# Altium project bootleg-ev.PrjPcb
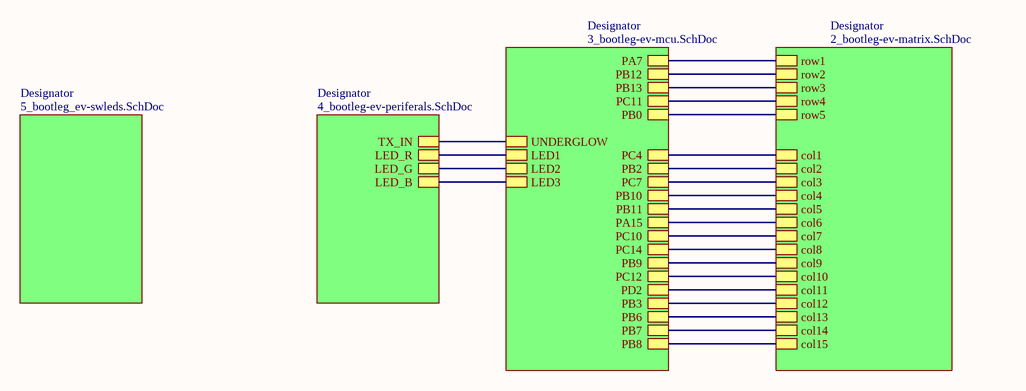
[diagram p0: 1_bootleg-ev_top.SchDoc]
Revision: B2 - MX; ProjectTitle: bootlegs
4 sheets, 169 parts. Net scope: hierarchical (ports join the sheet entries above them; power ports are global).
Board file: bootleg-ev.PcbDoc
Sheets:
  1_bootleg-ev_top.SchDoc
    Designator = 3_bootleg-ev-mcu.SchDoc
    Designator = 2_bootleg-ev-matrix.SchDoc
    Designator = 4_bootleg-ev-periferals.SchDoc

## Sheet 1_bootleg-ev_top.SchDoc: =ProjectTitle
size A4; Address1: github.com/4pplet/bootlegs; Address2: Licence: CERN-OHL-S; Address4: www.4pplet.com; Revision: B2 - MX; SheetNumber: 1; SheetTotal: 4; ProjectName: waffling60

### Sub-sheets
Designator = 3_bootleg-ev-mcu.SchDoc: PB10, PB3, PB8, PB9, PC10, PB0, PC11, PB7, PA15, PB6, PC14, PB13, PD2, UNDERGLOW, LED2, LED1, LED3, PC12, PB2, PB12, PB11, PA7, PC7, PC4
Designator = 2_bootleg-ev-matrix.SchDoc: col5, col7, col3, col1, row3, row1, row4, row2, row5, col4, col2, col6, col14, col10, col8, col9, col15, col11, col12, col13
Designator = 4_bootleg-ev-periferals.SchDoc: TX_IN, LED_B, LED_R, LED_G
Designator = 5_bootleg_ev-swleds.SchDoc (file not in this document): no entries

### Nets
NetD201_2: sheet Designator/PA7, sheet Designator/row1
NetD202_2: sheet Designator/PB12, sheet Designator/row2
NetD215_2: sheet Designator/PB13, sheet Designator/row3
NetD216_2: sheet Designator/PC11, sheet Designator/row4
NetD229_2: sheet Designator/PB0, sheet Designator/row5
NetLED401_4: sheet Designator/UNDERGLOW, sheet Designator/TX_IN
NetS201_2: sheet Designator/PC4, sheet Designator/col1
NetS203_2: sheet Designator/PB2, sheet Designator/col2
NetS205_2: sheet Designator/PC7, sheet Designator/col3
NetS207_2: sheet Designator/PB10, sheet Designator/col4
NetS209_2: sheet Designator/PB11, sheet Designator/col5
NetS211_2: sheet Designator/PA15, sheet Designator/col6
NetS213_2: sheet Designator/PC10, sheet Designator/col7
NetU301_3: sheet Designator/PC14, sheet Designator/col8
NetU301_39: sheet Designator/PB3, sheet Designator/col12
NetU301_42: sheet Designator/PB6, sheet Designator/col13
NetU301_43: sheet Designator/PB7, sheet Designator/col14
NetU301_45: sheet Designator/PB8, sheet Designator/col15
NetU301_46: sheet Designator/PB9, sheet Designator/col9
(unnamed): sheet Designator/PD2, sheet Designator/col11
(unnamed): sheet Designator/LED2, sheet Designator/LED_G
(unnamed): sheet Designator/LED1, sheet Designator/LED_R
(unnamed): sheet Designator/LED3, sheet Designator/LED_B
(unnamed): sheet Designator/PC12, sheet Designator/col10

### Notes on the sheet
- Title
- Size:
- Date:
- A4
- Number:
- Time:
- Revision:
- Sheet
- of
- File:

## Sheet 3_bootleg-ev-mcu.SchDoc: =ProjectTitle
size A4; Address1: github.com/4pplet/bootlegs; Address2: Licence: CERN-OHL-S; Address4: www.4pplet.com; Revision: B2 - MX; SheetNumber: 3; SheetTotal: 4
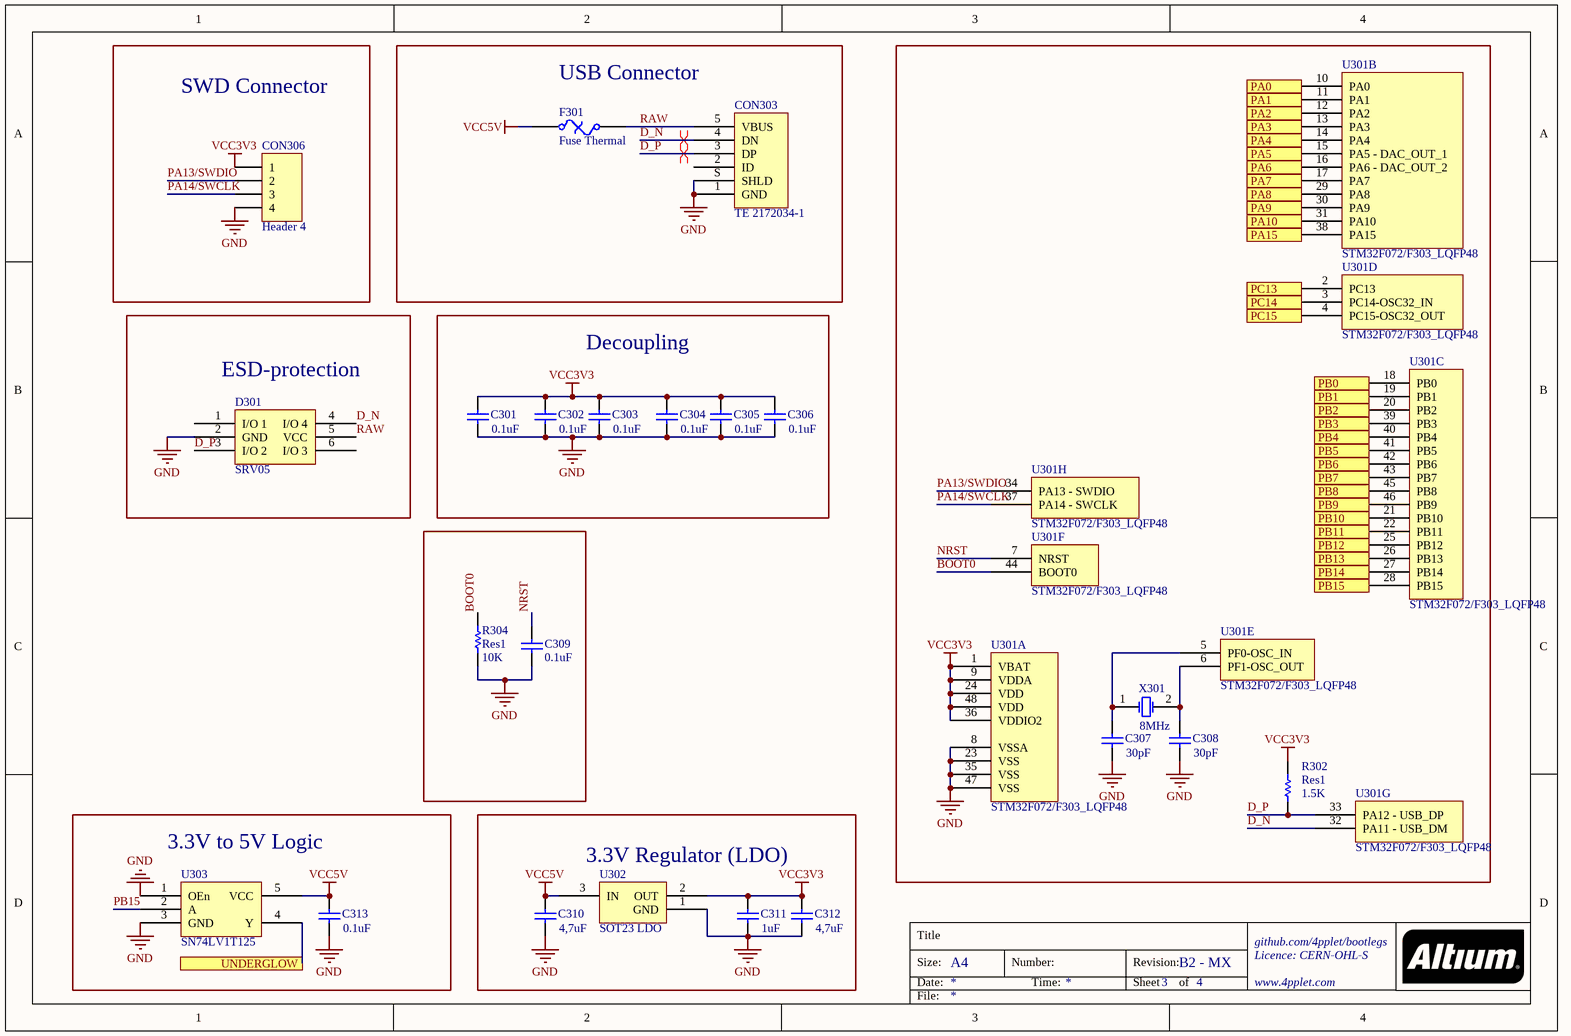
[diagram p1: 3_bootleg-ev-mcu.SchDoc]

### Parts
C301  value 0.1uF  [C0603[1608]]
C302  value 0.1uF  [C0603[1608]]
C303  value 0.1uF  [C0603[1608]]
C304  value 0.1uF  [C0603[1608]]
C305  value 0.1uF  [C0603[1608]]
C306  value 0.1uF  [C0603[1608]]
C307  value 30pF  [C0603[1608]]
C308  value 30pF  [C0603[1608]]
C309  value 0.1uF  [C0603[1608]]
C310  value 4,7uF  [C0603[1608]]
C311  value 1uF  [C0603[1608]]
C312  value 4,7uF  [C0603[1608]]
C313  value 0.1uF  [C0603[1608]]
CON303  TE 2172034-1  [TE 2172034-1]
CON306  Header 4  [HDR1X4]  (no BOM)
D301  SRV05  [SOT-23-6]
F301  Fuse Thermal  [C1206[3216]]
R302  Res1  value 1.5K  [R0603[1608]]
R304  Res1  value 10K  [R0603[1608]]
U301  STM32F072/F303_LQFP48  [STM32 - LQFP48, 7x7mm]  (parts A,B,C,D,E,F,G,H of 8)
U302  SOT23 LDO  [SOT-23-3]
U303  SN74LV1T125  [SOT-23-5]
X301  value 8MHz  [CTS 445-series crystal]  (hidden comment: XTAL)

### Blocks framed on the sheet
SWD Connector: CON306
USB Connector: CON303 F301
ESD-protection: D301
Decoupling: C301-C306
3.3V to 5V Logic: C313 U303
3.3V Regulator (LDO): C310-C312 U302

### Ports
PA0, PA1, PA2, PA3, PA4, PA5, PA6, PA7, PA8, PA9, PA10, PA15, PB0, PB1, PB2, PB3, PB4, PB5, PB6, PB7, PB8, PB9, PB10, PB11, PB12, PB13, PB14, PB15, PC13, PC14, PC15, UNDERGLOW

### Nets
GND: C301.1 C302.1 C303.1 C304.1 C305.1 C306.1 C307.1 C308.1 C309.2 C310.1 C311.1 C312.1 C313.1 CON303.1(GND) CON303.S(SHLD) CON306.4 D301.2(GND) R304.1 U301.8(VSSA) U301.23(VSS) U301.35(VSS) U301.47(VSS) U302.1(GND) U303.1(OEn) U303.3(GND)
VCC3V3: C301.2 C302.2 C303.2 C304.2 C305.2 C306.2 C311.2 C312.2 CON306.1 R302.1 U301.1(VBAT) U301.9(VDDA) U301.24(VDD) U301.36(VDDIO2) U301.48(VDD) U302.2(OUT)
VCC5V: C310.2 C313.2 F301.1 U302.3(IN) U303.5(VCC)
BOOT0: R304.2 U301.44(BOOT0)
D_N: CON303.4(DN) D301.4(I/O_4) U301.32(PA11_-_USB_DM)
D_P: CON303.3(DP) D301.3(I/O_2) R302.2 U301.33(PA12_-_USB_DP)
NRST: C309.1 U301.7(NRST)
PA13/SWDIO: CON306.2 U301.34(PA13_-_SWDIO)
PA14/SWCLK: CON306.3 U301.37(PA14_-_SWCLK)
PB15: U303.2(A)
RAW: CON303.5(VBUS) D301.5(VCC) F301.2
NetC307_2: C307.2 U301.5(PF0-OSC_IN) X301.1(OSC1)
NetC308_2: C308.2 U301.6(PF1-OSC_OUT) X301.2(OSC2)
NetD201_2: U301.17(PA7) ; port PA7
NetD202_2: U301.25(PB12) ; port PB12
NetD215_2: U301.26(PB13) ; port PB13
NetD229_2: U301.18(PB0) ; port PB0
NetLED401_4: U303.4(Y) ; port UNDERGLOW
NetS203_2: U301.20(PB2) ; port PB2
NetS207_2: U301.21(PB10) ; port PB10
NetS209_2: U301.22(PB11) ; port PB11
NetS211_2: U301.38(PA15) ; port PA15
NetU301_2: U301.2(PC13) ; port PC13
NetU301_3: U301.3(PC14-OSC32_IN) ; port PC14
NetU301_4: U301.4(PC15-OSC32_OUT) ; port PC15
NetU301_10: U301.10(PA0) ; port PA0
NetU301_11: U301.11(PA1) ; port PA1
NetU301_12: U301.12(PA2) ; port PA2
NetU301_13: U301.13(PA3) ; port PA3
NetU301_14: U301.14(PA4) ; port PA4
NetU301_15: U301.15(PA5_-_DAC_OUT_1) ; port PA5
NetU301_16: U301.16(PA6_-_DAC_OUT_2) ; port PA6
NetU301_19: U301.19(PB1) ; port PB1
NetU301_27: U301.27(PB14) ; port PB14
NetU301_28: U301.28(PB15) ; port PB15
NetU301_29: U301.29(PA8) ; port PA8
NetU301_30: U301.30(PA9) ; port PA9
NetU301_31: U301.31(PA10) ; port PA10
NetU301_39: U301.39(PB3) ; port PB3
NetU301_40: U301.40(PB4) ; port PB4
NetU301_41: U301.41(PB5) ; port PB5
NetU301_42: U301.42(PB6) ; port PB6
NetU301_43: U301.43(PB7) ; port PB7
NetU301_45: U301.45(PB8) ; port PB8
NetU301_46: U301.46(PB9) ; port PB9

Not connected (* = marked no-connect by the designer): CON303 2(ID); D301 1(I/O_1) 6(I/O_3)

### Layout directives
differential pair: D_N, D_P

### Notes on the sheet
- Title
- Size:
- Date:
- A4
- Number:
- Time:
- Revision:
- Sheet
- of
- File:

### Library data of the parts
C301-C306 C309 C313 = Cap: Capacitor; MRF.Part: CC0603KRX7R9BB104; MFG: KEMET; MFGPN: C0603C104M5RACTU; LCSC MFG: YAGEO; Version: 0603 imperial; LCSC Part #: C14663
C307 C308 = Cap: Capacitor; MRF.Part: CL10C300JB8NNNC; LCSC MFG: Samsung Electro-Mechanics; Version: 0603 imperial; LCSC Part #: C22397
C310 C312 = Cap: Capacitor; LCSC MFG: Samsung Electro-Mechanics; LCSC Part #: C19666
C311 = Cap: Capacitor; MRF.Part: CL10A105KB8NNNC; MFG: KEMET; MFGPN: C0603C104M5RACTU; LCSC MFG: Samsung Electro-Mechanics; Version: 0603 imperial; LCSC Part #: C15849
CON306 = Header 4: Header, 4-Pin
D301 = SRV05: MRF.Part: SRV05-4-P-T7; LCSC MFG: ProTek Devices; LCSC Part #: C85364
F301 = Fuse Thermal: Thermal Fuse; MRF.Part: ASMD1206-050; MFG: Bel Fuse Inc.; MFGPN: 0ZCJ0050FF2G; LCSC MFG: Shenzhen JDT Fuse; LCSC Part #: C135338
R302 = Res1: Resistor; MRF.Part: 0603WAF1501T5E; LCSC MFG: Uniroyal Elec; Version: 0603 imperial; LCSC Part #: C22843
R304 = Res1: Resistor; MRF.Part: 0603WAF1002T5E; MFG: Panasonic Electronic Components; MFGPN: ERJ-3EKF5101V; LCSC MFG: Uniroyal Elec; Version: 0603 imperial; LCSC Part #: C25804
U301 = STM32F072/F303_LQFP48: MFG: STMicroelectronics; MFGPN: STM32F072CBT6TR
U302 = SOT23 LDO: MRF.Part: XC6206P332MR; LCSC MFG: Torex Semicon; MFG: Texas Instruments; MFGPN: TPS7A0533PDBZ; LCSC Part #: C5446
U303 = SN74LV1T125: SN74LV1T125 or SN74LV1T34. Connect OE to GND; MRF.Part: SN74LV1T125DBVR; LCSC MFG: Texas Instruments; LCSC Part #: C473338; Version: SOT-23
X301 = XTAL: Crystal Oscillator; MRF.Part: X50328MSB2GI; LCSC MFG: Yangxing Tech; Version: SMD-5032_2P; LCSC Part #: C115962

## Sheet 2_bootleg-ev-matrix.SchDoc: =ProjectTitle
size A3; Address1: github.com/4pplet/bootlegs; Address2: Licence: CERN-OHL-S; Address4: www.4pplet.com; Revision: B2 - MX; SheetNumber: 2; SheetTotal: 4
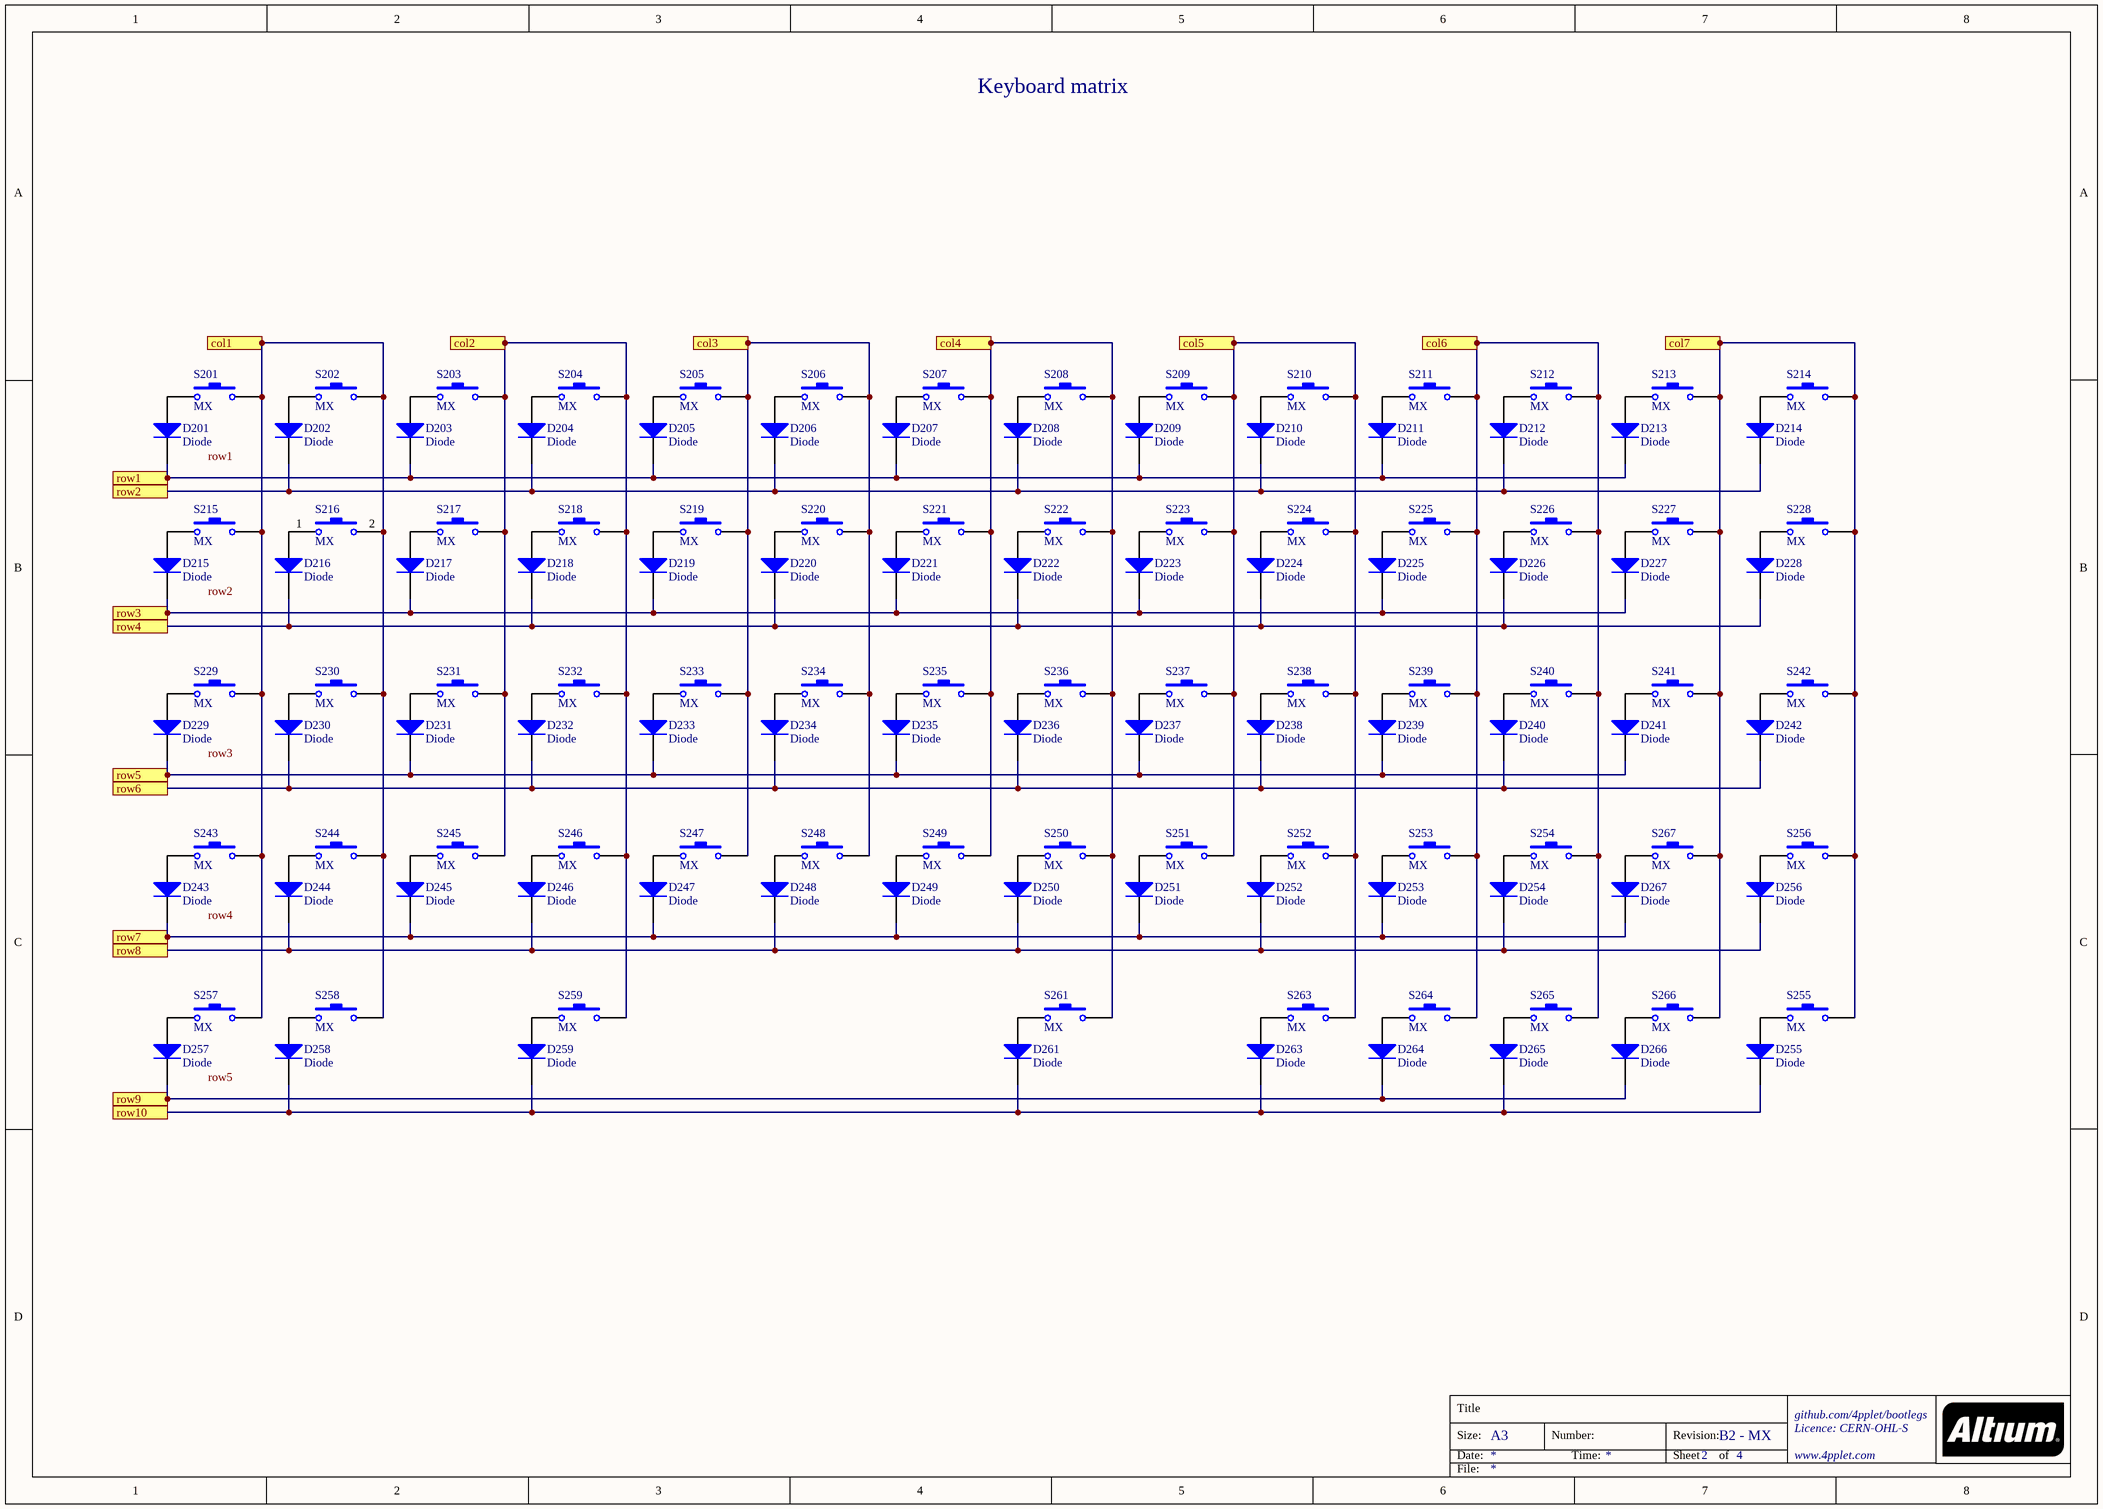
[diagram p2: 2_bootleg-ev-matrix.SchDoc]

### Parts
D201  Diode  [SOD-123]
D202  Diode  [SOD-123]
D203  Diode  [SOD-123]
D204  Diode  [SOD-123]
D205  Diode  [SOD-123]
D206  Diode  [SOD-123]
D207  Diode  [SOD-123]
D208  Diode  [SOD-123]
D209  Diode  [SOD-123]
D210  Diode  [SOD-123]
D211  Diode  [SOD-123]
D212  Diode  [SOD-123]
D213  Diode  [SOD-123]
D214  Diode  [SOD-123]
D215  Diode  [SOD-123]
D216  Diode  [SOD-123]
D217  Diode  [SOD-123]
D218  Diode  [SOD-123]
D219  Diode  [SOD-123]
D220  Diode  [SOD-123]
D221  Diode  [SOD-123]
D222  Diode  [SOD-123]
D223  Diode  [SOD-123]
D224  Diode  [SOD-123]
D225  Diode  [SOD-123]
D226  Diode  [SOD-123]
D227  Diode  [SOD-123]
D228  Diode  [SOD-123]
D229  Diode  [SOD-123]
D230  Diode  [SOD-123]
D231  Diode  [SOD-123]
D232  Diode  [SOD-123]
D233  Diode  [SOD-123]
D234  Diode  [SOD-123]
D235  Diode  [SOD-123]
D236  Diode  [SOD-123]
D237  Diode  [SOD-123]
D238  Diode  [SOD-123]
D239  Diode  [SOD-123]
D240  Diode  [SOD-123]
D241  Diode  [SOD-123]
D242  Diode  [SOD-123]
D243  Diode  [SOD-123]
D244  Diode  [SOD-123]
D245  Diode  [SOD-123]
D246  Diode  [SOD-123]
D247  Diode  [SOD-123]
D248  Diode  [SOD-123]
D249  Diode  [SOD-123]
D250  Diode  [SOD-123]
D251  Diode  [SOD-123]
D252  Diode  [SOD-123]
D253  Diode  [SOD-123]
D254  Diode  [SOD-123]
D255  Diode  [SOD-123]
D256  Diode  [SOD-123]
D257  Diode  [SOD-123]
D258  Diode  [SOD-123]
D259  Diode  [SOD-123]
D261  Diode  [SOD-123]
D263  Diode  [SOD-123]
D264  Diode  [SOD-123]
D265  Diode  [SOD-123]
D266  Diode  [SOD-123]
D267  Diode  [SOD-123]
S201  MX  [MX-switch - switched pol]  (no BOM)
S202  MX  [MX-switch - switched pol - connector]  (no BOM)
S203  MX  [MX-switch - switched pol]  (no BOM)
S204  MX  [MX-switch - switched pol]  (no BOM)
S205  MX  [MX-switch - switched pol]  (no BOM)
S206  MX  [MX-switch - switched pol]  (no BOM)
S207  MX  [MX-switch - switched pol]  (no BOM)
S208  MX  [MX-switch - switched pol]  (no BOM)
S209  MX  [MX-switch - switched pol]  (no BOM)
S210  MX  [MX-switch - switched pol]  (no BOM)
S211  MX  [MX-switch - switched pol]  (no BOM)
S212  MX  [MX-switch - switched pol]  (no BOM)
S213  MX  [MX-switch - switched pol]  (no BOM)
S214  MX  [MX-switch - switched pol]  (no BOM)
S215  MX  [MX-switch - 1.5U]  (no BOM)
S216  MX  [MX-switch - switched pol]  (no BOM)
S217  MX  [MX-switch - switched pol]  (no BOM)
S218  MX  [MX-switch - switched pol]  (no BOM)
S219  MX  [MX-switch - switched pol]  (no BOM)
S220  MX  [MX-switch - switched pol]  (no BOM)
S221  MX  [MX-switch - switched pol]  (no BOM)
S222  MX  [MX-switch - switched pol]  (no BOM)
S223  MX  [MX-switch - switched pol]  (no BOM)
S224  MX  [MX-switch - switched pol]  (no BOM)
S225  MX  [MX-switch - switched pol]  (no BOM)
S226  MX  [MX-switch]  (no BOM)
S227  MX  [MX-switch - switched pol]  (no BOM)
S228  MX  [MX-switch - backspace]  (no BOM)
S229  MX  [MX-switch - CAPS]  (no BOM)
S230  MX  [MX-switch - switched pol]  (no BOM)
S231  MX  [MX-switch - switched pol]  (no BOM)
S232  MX  [MX-switch - switched pol]  (no BOM)
S233  MX  [MX-switch - switched pol]  (no BOM)
S234  MX  [MX-switch - switched pol]  (no BOM)
S235  MX  [MX-switch - switched pol]  (no BOM)
S236  MX  [MX-switch - switched pol]  (no BOM)
S237  MX  [MX-switch - switched pol]  (no BOM)
S238  MX  [MX-switch - switched pol]  (no BOM)
S239  MX  [MX-switch]  (no BOM)
S240  MX  [MX-switch - switched pol]  (no BOM)
S241  MX  [MX-switch]  (no BOM)
S242  MX  [MX-switch - 1.5U]  (no BOM)
S243  MX  [MX-switch - Left shift]  (no BOM)
S244  MX  [MX-switch]  (no BOM)
S245  MX  [MX-switch - switched pol]  (no BOM)
S246  MX  [MX-switch - switched pol]  (no BOM)
S247  MX  [MX-switch - switched pol]  (no BOM)
S248  MX  [MX-switch - switched pol]  (no BOM)
S249  MX  [MX-switch - switched pol]  (no BOM)
S250  MX  [MX-switch - switched pol]  (no BOM)
S251  MX  [MX-switch - switched pol]  (no BOM)
S252  MX  [MX-switch - switched pol]  (no BOM)
S253  MX  [MX-switch - switched pol]  (no BOM)
S254  MX  [MX-switch - switched pol]  (no BOM)
S255  MX  [MX-switch]  (no BOM)
S256  MX  [MX-switch - Enter]  (no BOM)
S257  MX  [MX-switch - 1.5u MOD-L]  (no BOM)
S258  MX  [MX-switch - 1u MOD-L]  (no BOM)
S259  MX  [MX-switch - 1.5u MOD-L]  (no BOM)
S261  MX  [MX-switch - Space_V3]  (no BOM)
S263  MX  [MX-switch]  (no BOM)
S264  MX  [MX-switch - 1.5u MOD-R]  (no BOM)
S265  MX  [MX-switch - 1u MOD-R]  (no BOM)
S266  MX  [MX-switch - 1.5u MOD-R]  (no BOM)
S267  MX  [MX-switch - right shift]  (no BOM)

### Ports
col1, col2, col3, col4, col5, col6, col7, row1, row2, row3, row4, row5, row6, row7, row8, row9, row10

### Nets
NetD201_1: D201.1(A) S201.1
NetD201_2: D201.2(K) D203.2(K) D205.2(K) D207.2(K) D209.2(K) D211.2(K) D213.2(K) ; port row1
NetD202_1: D202.1(A) S202.1
NetD202_2: D202.2(K) D204.2(K) D206.2(K) D208.2(K) D210.2(K) D212.2(K) D214.2(K) ; port row2
NetD203_1: D203.1(A) S203.1
NetD204_1: D204.1(A) S204.1
NetD205_1: D205.1(A) S205.1
NetD206_1: D206.1(A) S206.1
NetD207_1: D207.1(A) S207.1
NetD208_1: D208.1(A) S208.1
NetD209_1: D209.1(A) S209.1
NetD210_1: D210.1(A) S210.1
NetD211_1: D211.1(A) S211.1
NetD212_1: D212.1(A) S212.1
NetD213_1: D213.1(A) S213.1
NetD214_1: D214.1(A) S214.1
NetD215_1: D215.1(A) S215.2
NetD215_2: D215.2(K) D217.2(K) D219.2(K) D221.2(K) D223.2(K) D225.2(K) D227.2(K) ; port row3
NetD216_1: D216.1(A) S216.1
NetD216_2: D216.2(K) D218.2(K) D220.2(K) D222.2(K) D224.2(K) D226.2(K) D228.2(K) ; port row4
NetD217_1: D217.1(A) S217.1
NetD218_1: D218.1(A) S218.1
NetD219_1: D219.1(A) S219.1
NetD220_1: D220.1(A) S220.1
NetD221_1: D221.1(A) S221.1
NetD222_1: D222.1(A) S222.1
NetD223_1: D223.1(A) S223.1
NetD224_1: D224.1(A) S224.1
NetD225_1: D225.1(A) S225.1
NetD226_1: D226.1(A) S226.1
NetD227_1: D227.1(A) S227.1
NetD228_1: D228.1(A) S228.2
NetD229_1: D229.1(A) S229.1
NetD229_2: D229.2(K) D231.2(K) D233.2(K) D235.2(K) D237.2(K) D239.2(K) D241.2(K) ; port row5
NetD230_1: D230.1(A) S230.1
NetD230_2: D230.2(K) D232.2(K) D234.2(K) D236.2(K) D238.2(K) D240.2(K) D242.2(K) ; port row6
NetD231_1: D231.1(A) S231.1
NetD232_1: D232.1(A) S232.1
NetD233_1: D233.1(A) S233.1
NetD234_1: D234.1(A) S234.1
NetD235_1: D235.1(A) S235.1
NetD236_1: D236.1(A) S236.1
NetD237_1: D237.1(A) S237.1
NetD238_1: D238.1(A) S238.1
NetD239_1: D239.1(A) S239.1
NetD240_1: D240.1(A) S240.1
NetD241_1: D241.1(A) S241.1
NetD242_1: D242.1(A) S242.1
NetD243_1: D243.1(A) S243.1
NetD243_2: D243.2(K) D245.2(K) D247.2(K) D249.2(K) D251.2(K) D253.2(K) D267.2(K) ; port row7
NetD244_1: D244.1(A) S244.1
NetD244_2: D244.2(K) D246.2(K) D248.2(K) D250.2(K) D252.2(K) D254.2(K) D256.2(K) ; port row8
NetD245_1: D245.1(A) S245.1
NetD246_1: D246.1(A) S246.1
NetD247_1: D247.1(A) S247.1
NetD248_1: D248.1(A) S248.1
NetD249_1: D249.1(A) S249.1
NetD250_1: D250.1(A) S250.1
NetD251_1: D251.1(A) S251.1
NetD252_1: D252.1(A) S252.1
NetD253_1: D253.1(A) S253.1
NetD254_1: D254.1(A) S254.1
NetD255_1: D255.1(A) S255.1
NetD255_2: D255.2(K) D258.2(K) D259.2(K) D261.2(K) D263.2(K) D265.2(K) ; port row10
NetD256_1: D256.1(A) S256.1
NetD257_1: D257.1(A) S257.2
NetD257_2: D257.2(K) D264.2(K) D266.2(K) ; port row9
NetD258_1: D258.1(A) S258.1
NetD259_1: D259.1(A) S259.1
NetD261_1: D261.1(A) S261.1
NetD263_1: D263.1(A) S263.1
NetD264_1: D264.1(A) S264.2
NetD265_1: D265.1(A) S265.1
NetD266_1: D266.1(A) S266.1
NetD267_1: D267.1(A) S267.1
NetS201_2: S201.2 S202.2 S215.1 S216.2 S229.2 S230.2 S243.2 S244.2 S257.1 S258.2 ; port col1
NetS203_2: S203.2 S204.2 S217.2 S218.2 S231.2 S232.2 S245.2 S246.2 S259.2 ; port col2
NetS205_2: S205.2 S206.2 S219.2 S220.2 S233.2 S234.2 S247.2 S248.2 ; port col3
NetS207_2: S207.2 S208.2 S221.2 S222.2 S235.2 S236.2 S249.2 S250.2 S261.2 ; port col4
NetS209_2: S209.2 S210.2 S223.2 S224.2 S237.2 S238.2 S251.2 S252.2 S263.2 ; port col5
NetS211_2: S211.2 S212.2 S225.2 S226.2 S239.2 S240.2 S253.2 S254.2 S264.1 S265.2 ; port col6
NetS213_2: S213.2 S214.2 S227.2 S228.1 S241.2 S242.2 S255.2 S256.2 S266.2 S267.2 ; port col7

### Notes on the sheet
- Keyboard matrix
- Labels drawn without touching a wire or pin: row1, row2, row3, row4, row5
- Title
- Size:
- Date:
- A3
- Number:
- Time:
- Revision:
- Sheet
- of
- File:

### Library data of the parts
D201-D259 D261 D263-D267 = Diode: Default Diode; MRF.Part: 1N4148W; LCSC MFG: ST(Semtech); Version: SOD-123; LCSC Part #: C81598
S201-S214 S216-S259 S261 S263-S267 = SW-PB: Switch
S215 = SW-PB: TAB

## Sheet 4_bootleg-ev-periferals.SchDoc: =ProjectTitle
size A4; Address1: github.com/4pplet/bootlegs; Address2: Licence: CERN-OHL-S; Address4: www.4pplet.com; Revision: B2 - MX; SheetNumber: 4; SheetTotal: 4
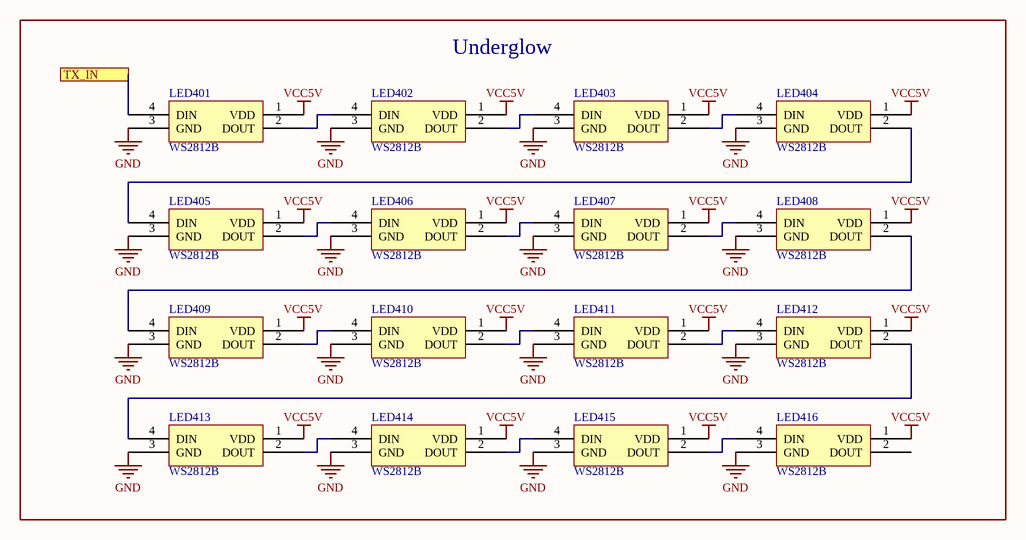
[diagram p3: 4_bootleg-ev-periferals.SchDoc]

### Parts
LED401  WS2812B  [WS2812B - 2020]
LED402  WS2812B  [WS2812B - 2020]
LED403  WS2812B  [WS2812B - 2020]
LED404  WS2812B  [WS2812B - 2020]
LED405  WS2812B  [WS2812B - 2020]
LED406  WS2812B  [WS2812B - 2020]
LED407  WS2812B  [WS2812B - 2020]
LED408  WS2812B  [WS2812B - 2020]
LED409  WS2812B  [WS2812B - 2020]
LED410  WS2812B  [WS2812B - 2020]
LED411  WS2812B  [WS2812B - 2020]
LED412  WS2812B  [WS2812B - 2020]
LED413  WS2812B  [WS2812B - 2020]
LED414  WS2812B  [WS2812B - 2020]
LED415  WS2812B  [WS2812B - 2020]
LED416  WS2812B  [WS2812B - 2020]

### Blocks framed on the sheet
Underglow: LED401-LED416

### Ports
TX_IN

### Nets
GND: LED401.3(GND) LED402.3(GND) LED403.3(GND) LED404.3(GND) LED405.3(GND) LED406.3(GND) LED407.3(GND) LED408.3(GND) LED409.3(GND) LED410.3(GND) LED411.3(GND) LED412.3(GND) LED413.3(GND) LED414.3(GND) LED415.3(GND) LED416.3(GND)
VCC5V: LED401.1(VDD) LED402.1(VDD) LED403.1(VDD) LED404.1(VDD) LED405.1(VDD) LED406.1(VDD) LED407.1(VDD) LED408.1(VDD) LED409.1(VDD) LED410.1(VDD) LED411.1(VDD) LED412.1(VDD) LED413.1(VDD) LED414.1(VDD) LED415.1(VDD) LED416.1(VDD)
NetLED401_2: LED401.2(DOUT) LED402.4(DIN)
NetLED401_4: LED401.4(DIN) ; port TX_IN
NetLED402_2: LED402.2(DOUT) LED403.4(DIN)
NetLED403_2: LED403.2(DOUT) LED404.4(DIN)
NetLED404_2: LED404.2(DOUT) LED405.4(DIN)
NetLED405_2: LED405.2(DOUT) LED406.4(DIN)
NetLED406_2: LED406.2(DOUT) LED407.4(DIN)
NetLED407_2: LED407.2(DOUT) LED408.4(DIN)
NetLED408_2: LED408.2(DOUT) LED409.4(DIN)
NetLED409_2: LED409.2(DOUT) LED410.4(DIN)
NetLED410_2: LED410.2(DOUT) LED411.4(DIN)
NetLED411_2: LED411.2(DOUT) LED412.4(DIN)
NetLED412_2: LED412.2(DOUT) LED413.4(DIN)
NetLED413_2: LED413.2(DOUT) LED414.4(DIN)
NetLED414_2: LED414.2(DOUT) LED415.4(DIN)
NetLED415_2: LED415.2(DOUT) LED416.4(DIN)

Not connected (* = marked no-connect by the designer): LED416 2(DOUT)

### Notes on the sheet
- Title
- Size:
- Date:
- A4
- Number:
- Time:
- Revision:
- Sheet
- of
- File:

### Library data of the parts
LED401-LED416 = WS2812B: MRF.Part: WS2812B-2020; LCSC MFG: Worldsemi; LCSC Part #: C965555

## Nets that join several sheets
GND: 3_bootleg-ev-mcu (25 pins), 4_bootleg-ev-periferals (16 pins)
VCC5V: 3_bootleg-ev-mcu (5 pins), 4_bootleg-ev-periferals (16 pins)
NetD201_2: 3_bootleg-ev-mcu (U301.17), 2_bootleg-ev-matrix (7 pins)
NetD202_2: 3_bootleg-ev-mcu (U301.25), 2_bootleg-ev-matrix (7 pins)
NetD215_2: 3_bootleg-ev-mcu (U301.26), 2_bootleg-ev-matrix (7 pins)
NetD229_2: 3_bootleg-ev-mcu (U301.18), 2_bootleg-ev-matrix (7 pins)
NetLED401_4: 3_bootleg-ev-mcu (U303.4), 4_bootleg-ev-periferals (LED401.4)
NetS203_2: 3_bootleg-ev-mcu (U301.20), 2_bootleg-ev-matrix (9 pins)
NetS207_2: 3_bootleg-ev-mcu (U301.21), 2_bootleg-ev-matrix (9 pins)
NetS209_2: 3_bootleg-ev-mcu (U301.22), 2_bootleg-ev-matrix (9 pins)
NetS211_2: 3_bootleg-ev-mcu (U301.38), 2_bootleg-ev-matrix (10 pins)